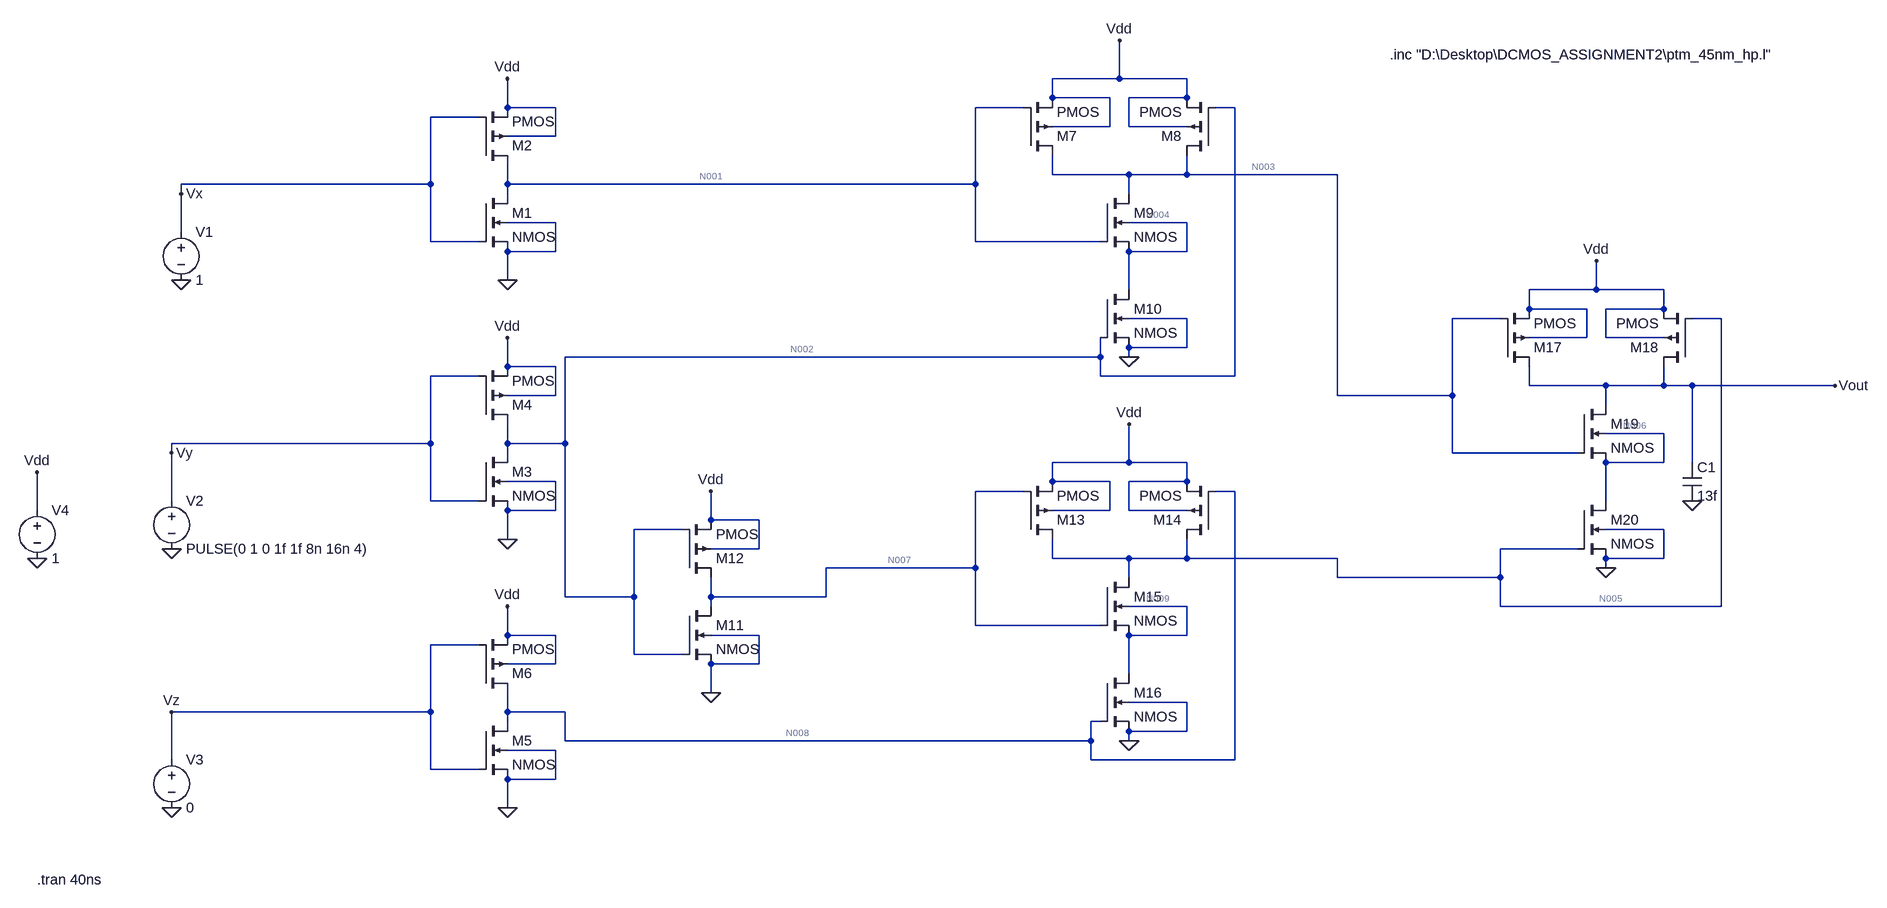
[diagram p0: schematic Q2.asc]
Q2.asc, the LTspice schematic file:
Version 4
SHEET 1 2952 1176
WIRE 1664 -176 1664 -240
WIRE 1664 -176 1552 -176
WIRE 1776 -176 1664 -176
WIRE 1552 -144 1552 -176
WIRE 1648 -144 1552 -144
WIRE 1776 -144 1776 -176
WIRE 1776 -144 1680 -144
WIRE 432 -128 432 -176
WIRE 512 -128 432 -128
WIRE 1504 -128 1424 -128
WIRE 1856 -128 1824 -128
WIRE 384 -112 304 -112
WIRE 1648 -96 1648 -144
WIRE 1648 -96 1552 -96
WIRE 1680 -96 1680 -144
WIRE 1776 -96 1680 -96
WIRE 512 -80 512 -128
WIRE 512 -80 432 -80
WIRE 1552 -16 1552 -48
WIRE 1680 -16 1552 -16
WIRE 1776 -16 1776 -48
WIRE 1776 -16 1680 -16
WIRE 2032 -16 1776 -16
WIRE 304 0 304 -112
WIRE 304 0 -112 0
WIRE 432 0 432 -32
WIRE 1424 0 1424 -128
WIRE 1424 0 432 0
WIRE -112 16 -112 0
WIRE 432 16 432 0
WIRE 1680 16 1680 -16
WIRE 512 64 432 64
WIRE 1776 64 1680 64
WIRE -112 80 -112 16
WIRE 304 96 304 0
WIRE 384 96 304 96
WIRE 1424 96 1424 0
WIRE 1632 96 1424 96
WIRE 512 112 512 64
WIRE 512 112 432 112
WIRE 1776 112 1776 64
WIRE 1776 112 1680 112
WIRE 432 160 432 112
WIRE 1680 176 1680 112
WIRE 2464 176 2464 128
WIRE 2464 176 2352 176
WIRE 2576 176 2464 176
WIRE 2352 208 2352 176
WIRE 2448 208 2352 208
WIRE 2576 208 2576 176
WIRE 2576 208 2480 208
WIRE 1776 224 1680 224
WIRE 2304 224 2224 224
WIRE 2672 224 2624 224
WIRE 2448 256 2448 208
WIRE 2448 256 2352 256
WIRE 2480 256 2480 208
WIRE 2576 256 2480 256
WIRE 1776 272 1776 224
WIRE 1776 272 1680 272
WIRE 1632 288 1632 256
WIRE 1632 288 528 288
WIRE 1680 288 1680 272
WIRE 432 304 432 256
WIRE 512 304 432 304
WIRE 384 320 304 320
WIRE 1632 320 1632 288
WIRE 1856 320 1856 -128
WIRE 1856 320 1632 320
WIRE 2352 336 2352 304
WIRE 2480 336 2352 336
WIRE 2576 336 2576 304
WIRE 2576 336 2480 336
WIRE 2624 336 2576 336
WIRE 2880 336 2624 336
WIRE 512 352 512 304
WIRE 512 352 432 352
WIRE 2032 352 2032 -16
WIRE 2224 352 2224 224
WIRE 2224 352 2032 352
WIRE 2480 368 2480 336
WIRE 2576 416 2480 416
WIRE 304 432 304 320
WIRE 304 432 -128 432
WIRE 432 432 432 400
WIRE 528 432 528 288
WIRE 528 432 432 432
WIRE -128 448 -128 432
WIRE 432 448 432 432
WIRE 2224 448 2224 352
WIRE 2432 448 2224 448
WIRE 1680 464 1680 400
WIRE 1680 464 1552 464
WIRE 1776 464 1680 464
WIRE 2576 464 2576 416
WIRE 2576 464 2480 464
WIRE 2624 464 2624 336
WIRE 512 496 432 496
WIRE 1552 496 1552 464
WIRE 1648 496 1552 496
WIRE 1776 496 1776 464
WIRE 1776 496 1680 496
WIRE 1504 512 1424 512
WIRE 1856 512 1824 512
WIRE -128 528 -128 448
WIRE 304 528 304 432
WIRE 384 528 304 528
WIRE 2480 528 2480 464
WIRE -352 544 -352 480
WIRE 512 544 512 496
WIRE 512 544 432 544
WIRE 1648 544 1648 496
WIRE 1648 544 1552 544
WIRE 1680 544 1680 496
WIRE 1776 544 1680 544
WIRE 928 560 928 512
WIRE 1008 560 928 560
WIRE 880 576 800 576
WIRE 2576 576 2480 576
WIRE 432 592 432 544
WIRE 1008 608 1008 560
WIRE 1008 608 928 608
WIRE 2432 608 2304 608
WIRE 1552 624 1552 592
WIRE 1680 624 1552 624
WIRE 1776 624 1776 592
WIRE 1776 624 1680 624
WIRE 2032 624 1776 624
WIRE 2576 624 2576 576
WIRE 2576 624 2480 624
WIRE 1424 640 1424 512
WIRE 1424 640 1120 640
WIRE 2480 640 2480 624
WIRE 1680 656 1680 624
WIRE 2032 656 2032 624
WIRE 2304 656 2304 608
WIRE 2304 656 2032 656
WIRE 528 688 528 432
WIRE 800 688 800 576
WIRE 800 688 528 688
WIRE 928 688 928 656
WIRE 1120 688 1120 640
WIRE 1120 688 928 688
WIRE 928 704 928 688
WIRE 1776 704 1680 704
WIRE 2304 704 2304 656
WIRE 2672 704 2672 224
WIRE 2672 704 2304 704
WIRE 1424 736 1424 640
WIRE 1632 736 1424 736
WIRE 432 752 432 704
WIRE 512 752 432 752
WIRE 1008 752 928 752
WIRE 1776 752 1776 704
WIRE 1776 752 1680 752
WIRE 384 768 304 768
WIRE 800 784 800 688
WIRE 880 784 800 784
WIRE 512 800 512 752
WIRE 512 800 432 800
WIRE 1008 800 1008 752
WIRE 1008 800 928 800
WIRE 1680 816 1680 752
WIRE 928 848 928 800
WIRE 1776 864 1680 864
WIRE 304 880 304 768
WIRE 304 880 -128 880
WIRE 432 880 432 848
WIRE 528 880 432 880
WIRE 432 896 432 880
WIRE 1632 896 1616 896
WIRE 1776 912 1776 864
WIRE 1776 912 1680 912
WIRE 528 928 528 880
WIRE 1616 928 1616 896
WIRE 1616 928 528 928
WIRE 1680 928 1680 912
WIRE 512 944 432 944
WIRE -128 960 -128 880
WIRE 1616 960 1616 928
WIRE 1856 960 1856 512
WIRE 1856 960 1616 960
WIRE 304 976 304 880
WIRE 384 976 304 976
WIRE 512 992 512 944
WIRE 512 992 432 992
WIRE 432 1040 432 992
FLAG -112 160 0
FLAG -128 608 0
FLAG -112 16 Vx
FLAG -128 448 Vy
FLAG 432 -176 Vdd
FLAG 432 160 0
FLAG 432 256 Vdd
FLAG 432 592 0
FLAG 432 704 Vdd
FLAG 432 1040 0
FLAG -128 1040 0
FLAG -128 880 Vz
FLAG 1680 288 0
FLAG 928 512 Vdd
FLAG 928 848 0
FLAG 1680 928 0
FLAG 2480 640 0
FLAG -352 480 Vdd
FLAG -352 624 0
FLAG 1664 -240 Vdd
FLAG 1680 400 Vdd
FLAG 2464 128 Vdd
FLAG 2624 528 0
FLAG 2880 336 Vout
DATAFLAG 2336 704 ""
SYMBOL voltage -112 64 R0
SYMATTR InstName V1
SYMATTR Value 1
SYMBOL voltage -128 512 R0
WINDOW 123 0 0 Left 0
WINDOW 39 0 0 Left 0
SYMATTR InstName V2
SYMATTR Value PULSE(0 1 0 1f 1f 8n 16n 4)
SYMBOL nmos4 384 16 R0
SYMATTR InstName M1
SYMATTR Value2 l=45nm w=300nm
SYMBOL pmos4 384 -32 M180
SYMATTR InstName M2
SYMATTR Value2 l=45nm w=600nm
SYMBOL nmos4 384 448 R0
SYMATTR InstName M3
SYMATTR Value2 l=45nm w=300nm
SYMBOL pmos4 384 400 M180
SYMATTR InstName M4
SYMATTR Value2 l=45nm w=600nm
SYMBOL nmos4 384 896 R0
SYMATTR InstName M5
SYMATTR Value2 l=45nm w=300nm
SYMBOL pmos4 384 848 M180
SYMATTR InstName M6
SYMATTR Value2 l=45nm w=600nm
SYMBOL voltage -128 944 R0
SYMATTR InstName V3
SYMATTR Value 0
SYMBOL pmos4 1504 -48 M180
SYMATTR InstName M7
SYMATTR Value2 l=45nm w=550nm
SYMBOL pmos4 1824 -48 R180
SYMATTR InstName M8
SYMATTR Value2 l=45nm w=550nm
SYMBOL nmos4 1632 16 R0
SYMATTR InstName M9
SYMATTR Value2 l=45nm w=550nm
SYMBOL nmos4 1632 176 R0
SYMATTR InstName M10
SYMATTR Value2 l=45nm w=550nm
SYMBOL nmos4 880 704 R0
SYMATTR InstName M11
SYMATTR Value2 l=45nm w=620nm
SYMBOL pmos4 880 656 M180
SYMATTR InstName M12
SYMATTR Value2 l=45nm w=1240nm
SYMBOL pmos4 1504 592 M180
SYMATTR InstName M13
SYMATTR Value2 l=45nm w=1905nm
SYMBOL pmos4 1824 592 R180
SYMATTR InstName M14
SYMATTR Value2 l=45nm w=1905nm
SYMBOL nmos4 1632 656 R0
SYMATTR InstName M15
SYMATTR Value2 l=45nm w=1905nm
SYMBOL nmos4 1632 816 R0
SYMATTR InstName M16
SYMATTR Value2 l=45nm w=1905nm
SYMBOL pmos4 2304 304 M180
SYMATTR InstName M17
SYMATTR Value2 l=45nm w=2930nm
SYMBOL pmos4 2624 304 R180
SYMATTR InstName M18
SYMATTR Value2 l=45nm w=2930nm
SYMBOL nmos4 2432 368 R0
SYMATTR InstName M19
SYMATTR Value2 l=45nm w=2930nm
SYMBOL nmos4 2432 528 R0
SYMATTR InstName M20
SYMATTR Value2 l=45nm w=2930nm
SYMBOL voltage -352 528 R0
SYMATTR InstName V4
SYMATTR Value 1
SYMBOL cap 2608 464 R0
SYMATTR InstName C1
SYMATTR Value 13f
TEXT 2120 -216 Left 2 !.inc "D:\\Desktop\\DCMOS_ASSIGNMENT2\\ptm_45nm_hp.l"
TEXT -352 1160 Left 2 !.tran 40ns

The netlist it stands for:
* Q2.asc
V1 Vx 0 1
V2 Vy 0 PULSE(0 1 0 1f 1f 8n 16n 4)
M1 N001 Vx 0 0 NMOS l=45nm w=300nm
M2 N001 Vx Vdd Vdd PMOS l=45nm w=600nm
M3 N002 Vy 0 0 NMOS l=45nm w=300nm
M4 N002 Vy Vdd Vdd PMOS l=45nm w=600nm
M5 N008 Vz 0 0 NMOS l=45nm w=300nm
M6 N008 Vz Vdd Vdd PMOS l=45nm w=600nm
V3 Vz 0 0
M7 N003 N001 Vdd Vdd PMOS l=45nm w=550nm
M8 N003 N002 Vdd Vdd PMOS l=45nm w=550nm
M9 N003 N001 N004 N004 NMOS l=45nm w=550nm
M10 N004 N002 0 0 NMOS l=45nm w=550nm
M11 N007 N002 0 0 NMOS l=45nm w=620nm
M12 N007 N002 Vdd Vdd PMOS l=45nm w=1240nm
M13 N005 N007 Vdd Vdd PMOS l=45nm w=1905nm
M14 N005 N008 Vdd Vdd PMOS l=45nm w=1905nm
M15 N005 N007 N009 N009 NMOS l=45nm w=1905nm
M16 N009 N008 0 0 NMOS l=45nm w=1905nm
M17 Vout N003 Vdd Vdd PMOS l=45nm w=2930nm
M18 Vout N005 Vdd Vdd PMOS l=45nm w=2930nm
M19 Vout N003 N006 N006 NMOS l=45nm w=2930nm
M20 N006 N005 0 0 NMOS l=45nm w=2930nm
V4 Vdd 0 1
C1 Vout 0 13f
.model NMOS NMOS
.model PMOS PMOS
.lib standard.mos
.inc "D:\Desktop\DCMOS_ASSIGNMENT2\ptm_45nm_hp.l"
.tran 40ns
.backanno
.end

* Results of the author's LTspice run, read from the files saved beside the schematic
* Operating Point, zero values left out:
*   V(vx) = 1 V
*   V(n001) = 3.141 µV
*   V(vdd) = 1 V
*   V(n002) = 1 V
*   V(n008) = 1 V
*   V(n003) = 1 V
*   V(n004) = 4.81 µV
*   V(n007) = 3.629 µV
*   V(n005) = 1 V
*   V(n009) = 4.853 µV
*   V(vout) = 4.997 µV
*   V(n006) = 2.543 µV
*   Id(M1) = 4.012 nA
*   Ig(M1) = 112.3 pA
*   Ib(M1) = -24.11 pA
*   Is(M1) = -4.1 nA
*   Id(M3) = 6.148 nA
*   Ig(M3) = -46.4 pA
*   Ib(M3) = -1.011 pA
*   Is(M3) = -6.1 nA
*   Id(M5) = 6.148 nA
*   Ig(M5) = -46.4 pA
*   Ib(M5) = -1.011 pA
*   Is(M5) = -6.1 nA
*   Id(M9) = 11.45 nA
*   Ig(M9) = -86.4 pA
*   Ib(M9) = -1.011 pA
*   Is(M9) = -11.36 nA
*   Id(M10) = 11.36 nA
*   Ig(M10) = 209 pA
*   Ib(M10) = -44.89 pA
*   Is(M10) = -11.52 nA
*   Id(M11) = 9.646 nA
*   Ig(M11) = 236.1 pA
*   Ib(M11) = -50.71 pA
*   Is(M11) = -9.832 nA
*   Id(M15) = 40.17 nA
*   Ig(M15) = -303.2 pA
*   Ib(M15) = -1.014 pA
*   Is(M15) = -39.87 nA
*   Id(M16) = 39.87 nA
*   Ig(M16) = 733.6 pA
*   Ib(M16) = -157.5 pA
*   Is(M16) = -40.45 nA
*   Id(M19) = 30.81 nA
*   Ig(M19) = 1.13 nA
*   Ib(M19) = -242.7 pA
*   Is(M19) = -31.69 nA
*   Id(M20) = 31.94 nA
*   Ig(M20) = 1.13 nA
*   Ib(M20) = -242.7 pA
*   Is(M20) = -32.82 nA
*   Id(M2) = -3.112 nA
*   Ig(M2) = 433 pA
*   Ib(M2) = 1.01 pA
*   Is(M2) = 2.678 nA
*   Id(M4) = -7.496 nA
*   Ig(M4) = -889 pA
*   Ib(M4) = 18.43 pA
*   Is(M4) = 8.366 nA
*   Id(M6) = -6.881 nA
*   Ig(M6) = -889 pA
*   Ib(M6) = 18.43 pA
*   Is(M6) = 7.752 nA
*   Id(M7) = -14.72 nA
*   Ig(M7) = -813.6 pA
*   Ib(M7) = 16.87 pA
*   Is(M7) = 15.52 nA
*   Id(M12) = -6.488 nA
*   Ig(M12) = 902.8 pA
*   Ib(M12) = 1.01 pA
*   Is(M12) = 5.584 nA
*   Id(M13) = -43.45 nA
*   Ig(M13) = -2.855 nA
*   Ib(M13) = 59.18 pA
*   Is(M13) = 46.24 nA
*   Id(M17) = -15.4 nA
*   Ig(M17) = 2.143 nA
*   Ib(M17) = 1.011 pA
*   Is(M17) = 13.26 nA
*   Id(M18) = -15.4 nA
*   Ig(M18) = 2.143 nA
*   Ib(M18) = 1.011 pA
*   Is(M18) = 13.26 nA
*   I(V1) = -545.3 pA
*   I(V2) = 935.4 pA
*   I(V3) = 935.4 pA
*   I(V4) = -112.8 nA
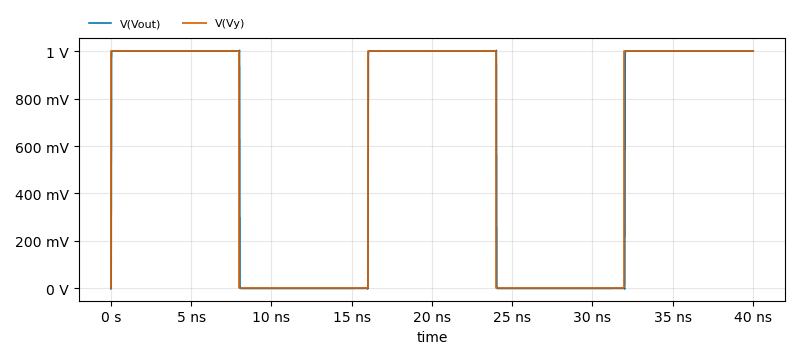
[diagram p1: Transient Analysis of Q2.asc, plotted from the saved traces]
* Transient Analysis, 1 run:
*   V(Vout): min -1.383 mV, max 1.003 V, average 599.3 mV, rms 773.8 mV, last 1 V
*   V(Vy): min 0 V, max 1 V, average 600 mV, rms 774.6 mV, last 1 V